# Altium project ControllerV1.0.PrjPcb
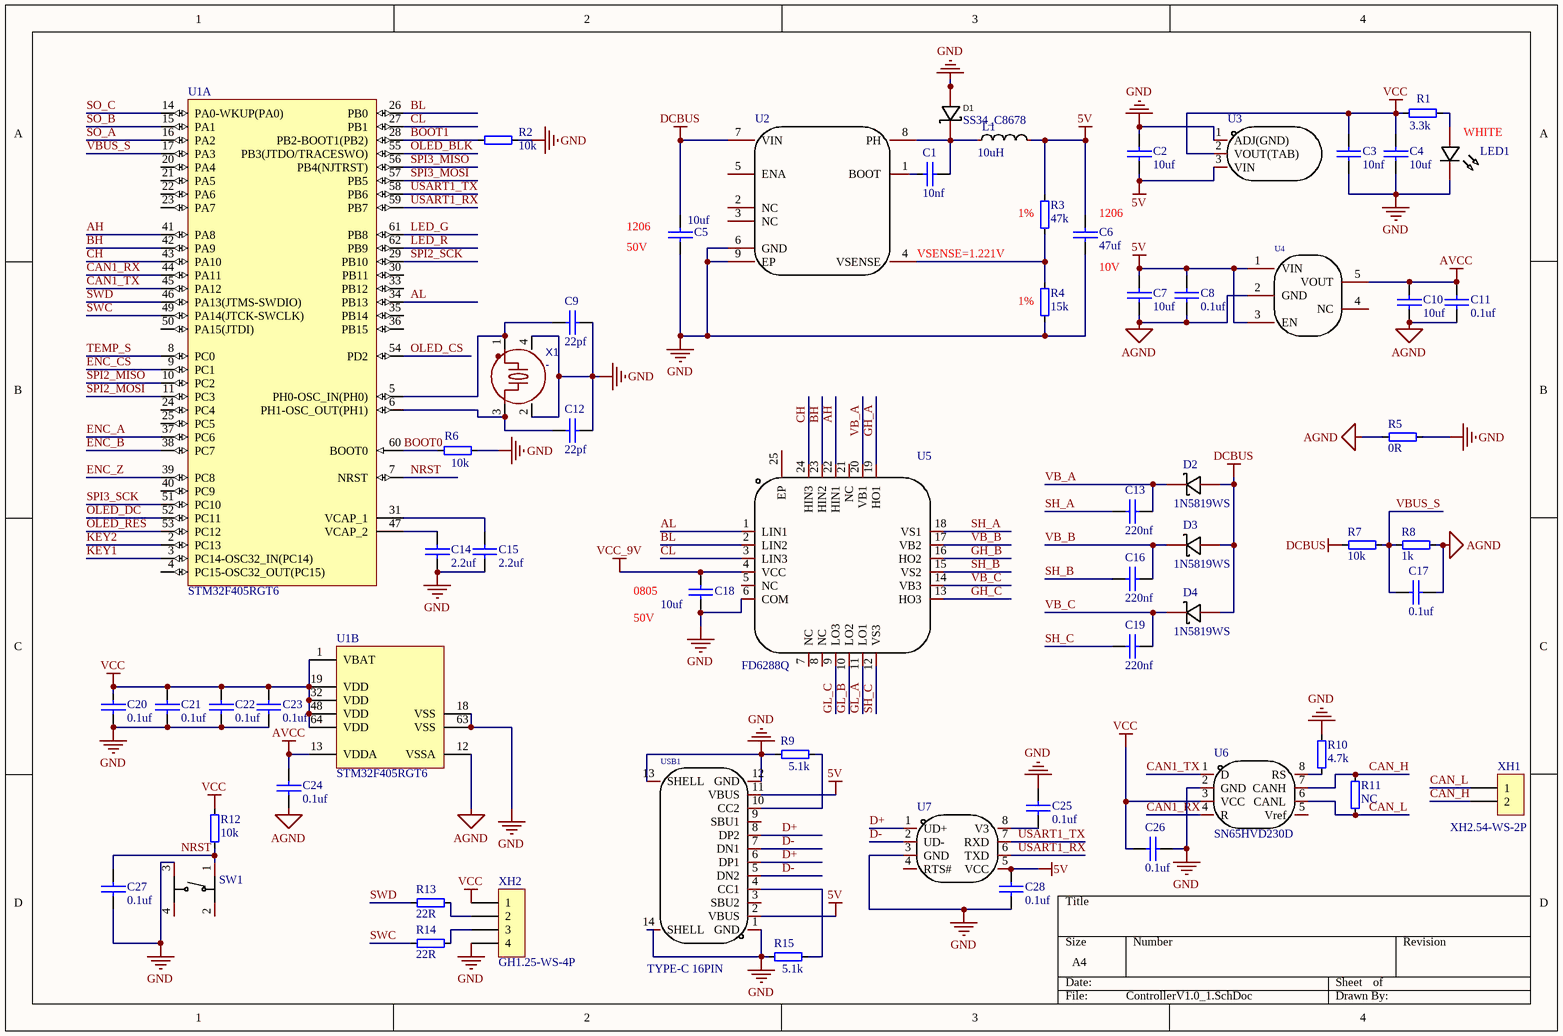
[diagram p0: ControllerV1.0_1.SchDoc]
2 sheets, 92 parts. Net scope: global (net labels, ports and power ports of the same name join across sheets).
Board file: ControllerV1.0.PcbDoc
Sheets:
  ControllerV1.0_1.SchDoc
  ControllerV1.0_2.SchDoc

## Sheet ControllerV1.0_1.SchDoc
size A4; SheetNumber: 1; SheetTotal: 2

### Parts
C1  10nf  [0603C]
C2  10uf  [0603C]
C3  10nf  [0603C]
C4  10uf  [0603C]
C5  10uf  [1206C]
C6  47uf  [1206C]
C7  10uf  [0603C]
C8  0.1uf  [0603C]
C9  22pf  [0603C]
C10  10uf  [0603C]
C11  0.1uf  [0603C]
C12  22pf  [0603C]
C13  220nf  [0603C]
C14  2.2uf  [0603C]
C15  2.2uf  [0603C]
C16  220nf  [0603C]
C17  0.1uf  [0603C]
C18  10uf  [0805C]
C19  220nf  [0603C]
C20  0.1uf  [0603C]
C21  0.1uf  [0603C]
C22  0.1uf  [0603C]
C23  0.1uf  [0603C]
C24  0.1uf  [0603C]
C25  0.1uf  [0603C]
C26  0.1uf  [0603C]
C27  0.1uf  [0603C]
C28  0.1uf  [0603C]
D1  SS34_C8678  [SS34]
D2  1N5819WS  [SOD-323]
D3  1N5819WS  [SOD-323]
D4  1N5819WS  [SOD-323]
L1  10uH  [IND-SMD_L3.0-W3.0_SWPA3010S]
LED1  LED_0603-B  [LED_0603]  (value not drawn)
R1  3.3k  [0603R]
R2  10k  [0603R]
R3  47k  [0603R]
R4  15k  [0603R]
R5  0R  [0603R]
R6  10k  [0603R]
R7  10k  [0603R]
R8  1k  [0603R]
R9  5.1k  [0603R]
R10  4.7k  [0603R]
R11  NC  [0603R]
R12  10k  [0603R]
R13  22R  [0603R]
R14  22R  [0603R]
R15  5.1k  [0603R]
SW1  TS-1187A-B-A-B  [TSW SMD-4*4*1.5]  (value not drawn)
U1  STM32F405RGT6  [LQFP_64]  (parts A,B of 2)
U2  TPS5450DDAR  [SOP-8-EP]  (value not drawn)
U3  AMS1117-3.3_C347256  [SOT-89]  (value not drawn)
U4  RT9013-33GB  [SOT-23-5]  (value not drawn)
U5  FD6288Q  [QFN-24-EP(4x4)]
U6  SN65HVD230D  [SOP-8]
U7  CH340N  [SOP-8]  (value not drawn)
USB1  TYPE-C 16PIN  [USB-C-SMD_TYPE-C-6PIN-2MD-073]
X1  -  [OSC 2520-4P]
XH1  XH2.54-WS-2P  [XH2.54-WS-2P]
XH2  GH1.25-WS-4P  [GH1.25-WS-4P]

### Nets
5V: C2.2 C6.1 C7.1 C8.1 C28.1 L1.2 R3.2 U3.3(VIN) U4.1(VIN) U4.3(EN) U7.5(VCC) USB1.2(VBUS) USB1.11(VBUS)
AGND: C7.2 C8.2 C10.2 C11.2 C17.2 C24.2 R5.2 R8.1 U1.12(VSSA) U4.2(GND)
AVCC: C10.1 C11.1 C24.1 U1.13(VDDA) U4.5(VOUT)
DCBUS: C5.1 D2.2(A) D3.2(A) D4.2(A) R7.2 U2.7(VIN)
GND: C2.1 C3.2 C4.2 C5.2 C6.2 C9.2 C12.2 C14.2 C15.2 C18.2 C20.2 C21.2 C22.2 C23.2 C25.2 C26.2 C27.2 C28.2 D1.2(A) LED1.1(C) R2.2 R4.1 R5.1 R6.2 R9.1 R10.2 R15.1 SW1.3(C) U1.18(VSS) U1.63(VSS) U2.6(GND) U2.9(EP) U3.1(ADJ(GND)) U5.6(COM) U6.2(GND) U7.3(GND) USB1.1(GND) USB1.12(GND) USB1.13(SHELL) USB1.14(SHELL) X1.2(GND) X1.4(GND) XH2.4
VCC: C3.1 C4.1 C20.1 C21.1 C22.1 C23.1 C26.1 R1.2 R12.2 U1.1(VBAT) U1.19(VDD) U1.32(VDD) U1.48(VDD) U1.64(VDD) U3.2(VOUT(TAB)) U6.3(VCC) XH2.1
VCC_9V: C18.1 U5.4(VCC)
AH: U1.41(PA8) U5.22(HIN1)
AL: U1.34(PB13) U5.1(LIN1)
BH: U1.42(PA9) U5.23(HIN2)
BL: U1.26(PB0) U5.2(LIN2)
BOOT0: R6.1 U1.60(BOOT0)
BOOT1: R2.1 U1.28(PB2-BOOT1(PB2))
CAN1_RX: U1.44(PA11) U6.4(R)
CAN1_TX: U1.45(PA12) U6.1(D)
CAN_H: R11.2 U6.7(CANH) XH1.2
CAN_L: R11.1 U6.6(CANL) XH1.1
CH: U1.43(PA10) U5.24(HIN3)
CL: U1.27(PB1) U5.3(LIN3)
D+: U7.1(UD+) USB1.6(DP1) USB1.8(DP2)
D-: U7.2(UD-) USB1.5(DN2) USB1.7(DN1)
ENC_A: U1.37(PC6)
ENC_B: U1.38(PC7)
ENC_CS: U1.9(PC1)
ENC_Z: U1.39(PC8)
GH_A: U5.19(HO1)
GH_B: U5.16(HO2)
GH_C: U5.13(HO3)
GL_A: U5.11(LO1)
GL_B: U5.10(LO2)
GL_C: U5.9(LO3)
KEY1: U1.3(PC14-OSC32_IN(PC14))
KEY2: U1.2(PC13)
LED_G: U1.61(PB8)
LED_R: U1.62(PB9)
NRST: C27.1 R12.1 SW1.1(A) U1.7(NRST)
OLED_BLK: U1.55(PB3(JTDO/TRACESWO))
OLED_CS: U1.54(PD2)
OLED_DC: U1.52(PC11)
OLED_RES: U1.53(PC12)
SH_A: C13.1 U5.18(VS1)
SH_B: C16.1 U5.15(VS2)
SH_C: C19.1 U5.12(VS3)
SO_A: U1.16(PA2)
SO_B: U1.15(PA1)
SO_C: U1.14(PA0-WKUP(PA0))
SPI2_MISO: U1.10(PC2)
SPI2_MOSI: U1.11(PC3)
SPI2_SCK: U1.29(PB10)
SPI3_MISO: U1.56(PB4(NJTRST))
SPI3_MOSI: U1.57(PB5)
SPI3_SCK: U1.51(PC10)
SWC: R14.1 U1.49(PA14(JTCK-SWCLK))
SWD: R13.1 U1.46(PA13(JTMS-SWDIO))
TEMP_S: U1.8(PC0)
USART1_RX: U1.59(PB7) U7.6(TXD)
USART1_TX: U1.58(PB6) U7.7(RXD)
VB_A: C13.2 D2.1(K) U5.20(VB1)
VB_B: C16.2 D3.1(K) U5.17(VB2)
VB_C: C19.2 D4.1(K) U5.14(VB3)
VBUS_S: C17.1 R7.1 R8.2 U1.17(PA3)
NetC1_1: C1.1 U2.1(BOOT)
NetC1_2: C1.2 D1.1(K) L1.1 U2.8(PH)
NetC9_1: C9.1 U1.5(PH0-OSC_IN(PH0)) X1.1
NetC12_1: C12.1 U1.6(PH1-OSC_OUT(PH1)) X1.3
NetC14_1: C14.1 U1.47(VCAP_2)
NetC15_1: C15.1 U1.31(VCAP_1)
NetC25_1: C25.1 U7.8(V3)
NetLED1_2: LED1.2(A) R1.1
NetR3_1: R3.1 R4.2 U2.4(VSENSE)
NetR9_2: R9.2 USB1.10(CC2)
NetR10_1: R10.1 U6.8(RS)
NetR13_2: R13.2 XH2.2
NetR14_2: R14.2 XH2.3
NetR15_2: R15.2 USB1.4(CC1)

Not connected (* = marked no-connect by the designer): SW1 2(B) 4(D); U1 4(PC15-OSC32_OUT(PC15)) 20(PA4) 21(PA5) 22(PA6) 23(PA7) 24(PC4) 25(PC5) 30(PB11) 33(PB12) 35(PB14) 36(PB15) 40(PC9) 50(PA15(JTDI)); U2 2(NC) 3(NC) 5(ENA); U4 4(NC); U5 5(NC) 7(NC) 8(NC) 21(NC) 25(EP); U6 5(Vref); U7 4(RTS#); USB1 3(SBU2) 9(SBU1)

### Notes on the sheet
- (near LED1) WHITE
- (near C5) 1206
- (near C5) 50V
- (near R3) 1%
- (near C6) 1206
- (near U2) VSENSE=1.221V
- (near R4) 1%
- 10V
- (near C18) 0805
- (near C18) 50V

### Library data of the parts
C1-C28 = CAP: 贴片电容
D1 = SS34: 肖特基二极管; Manufacturer: MDD; Add into BOM: yes; Name: SS34; Symbol: SS34_C8678; Device: SS34_C8678; LCSC Part Name: SS34; Supplier Part: C8678; Manufacturer Part: SS34; Supplier Footprint: SMA(DO-214AC); JLCPCB Part Class: Basic Part; Datasheet: https://atta.szlcsc.com/upload/public/pdf/source/20220408/D0396E57A6E83C6AFC0ED25EC9EDE030.pdf; Supplier: LCSC; Convert to PCB: yes
D2-D4 = 1N5819WS: 肖特基二极管; Manufacturer: Hottech(合科泰); Device: 1N5819WS_C191023; Add into BOM: yes; Forward Voltage (Vf@If): 600mV@1A; Reverse Voltage (Vr): 40V; Average Rectified Current (Io): 1A; Symbol: 1N5819WS; Supplier: LCSC; Supplier Part: C191023; Manufacturer Part: 1N5819WS; JLCPCB Part Class: 基础库; LCSC Part Name: 电压:40V 电流:1A; Supplier Footprint: SOD-323; Datasheet: https://atta.szlcsc.com/upload/public/pdf/source/20220428/3CB86FD8D28D653594B4E35F9D5AEFD9.pdf; Convert to PCB: yes
L1 = SWPA3015S100MT: 电感值:10uH;精度:±20%;额定电流:920mA;; Manufacturer: SXN(顺翔诺); Symbol: SMDRI74-220M; Add into BOM: yes; Value: 22uH; Tolerance: ±20%; Rated Current: 1.23A; DC Resistance (DCR): 110mΩ; Device: SMDRI74-220M; LCSC Part Name: 22uH ±20% 1.23A 110mΩ; Supplier Part: C164083; Manufacturer Part: SMDRI74-220M; Supplier Footprint: SMD; JLCPCB Part Class: Extended Part; Datasheet: https://atta.szlcsc.com/upload/public/pdf/source/20210810/6F96FDC19AA308DD2AD166FFB9640E87.pdf; Supplier: LCSC; Convert to PCB: yes
LED1 = LED: Symbol: LED_B; Convert to PCB: yes; Device: LED_0603-B; Add into BOM: yes; Supplier Footprint: 0603
R1-R15 = RES: 贴片电阻
SW1 = TS-1187A-B-A-B: 轻触开关; Manufacturer: XKB Connectivity(中国星坤); Add into BOM: yes; Circuit: 单刀单掷; Actuator Style: 圆形按钮; Switch Length: 5.1mm; Switch Height: 1.5mm; Strike Gundam: 不带; Contact Current: 50mA; Voltage Rating (DC): 12V; Actuator/Cap Color: 金色; With Lamp: 无; Operating Force: 160gf; Mechanical Life: 10万次; Symbol: TS-1187A-B-A-B; Device: TS-1187A-B-A-B; Supplier: LCSC; Supplier Part: C318884; Manufacturer Part: TS-1187A-B-A-B; JLCPCB Part Class: 基础库; LCSC Part Name: 5.1*5.1*1.5mm 立贴 轻触开关; Supplier Footprint: SMD; Datasheet: https://atta.szlcsc.com/upload/public/pdf/source/20200227/C318890_053E50208A88A7BA1965D8746000774E.pdf; Convert to PCB: yes; Switch Width: 5.1mm; Mounting Style: 立贴; Insulation Resistance: -; Operating Temperature: -30℃~+85℃
U1 = STM32F405RGT6: ARM Cortex-M4 32-bit MCU+FPU, 210 DMIPS, 1024 kB Flash, 192 kB Internal RAM, 51 I/Os, 64-pin LQFP, -40 to 85 degC, Tray; Manufacturer: STMicroelectronics; D/A Converter: 2x12-bit; FLASH Size (Prog) (kB): 1024; I/Os (High Current): 51; Internal RAM Size (kB): 192; Operating Frequency(F) (Processor speed) (MHz): 168; Supply Voltage(Vcc) max (V): 3.6; Supply Voltage(Vcc) min (V): 1.8; DatasheetVersion: Rev. 4; PackageVersion: Rev. 4, 06/2013; PackageReference: LQFP64; PackageDescription: 64-Pin Low Profile Quad Flat Package, 10 x 10 mm Body, 0.5 mm Pitch; Supplier 1: Digi-Key; Supplier Part Number 1: 497-11767-ND; Supplier 2: Farnell; Supplier Part Number 2: 2064363; Supplier 3: Newark; Supplier Part Number 3: 73T2329; Supplier 4: Mouser; Supplier Part Number 4: 511-STM32F405RGT6; Core: ARM Cortex-M4; Packing: Tray; Mounting Technology: Surface Mount; PartNumber: STM32F405RGT6; ComponentLink1Description: Manufacturer URL; ComponentLink1URL: http://www.st.com/web/en/home.html; ComponentLink2Description: Datasheet; ComponentLink2URL: http://www.st.com/st-web-ui/static/active/en/resource/technical/document/datasheet/DM00037051.pdf; ComponentLink3Description: Package Specification; ComponentLink3URL: http://www.st.com/st-web-ui/static/active/en/resource/technical/document/datasheet/DM00037051.pdf
U2 = TPS5450DDAR: Manufacturer: TI(德州仪器); Add into BOM: yes; Function: 降压型; Input Voltage: 5.5V~36V; Output Voltage: 1.221V~31.32V; Output Current (Max): 5A; Switching Frequency: 500kHz; Output Type: 可调; Synchronous Rectification: 否; Number of Outputs: 1; Topology: 降压式; Symbol: TPS5450DDAR; Device: TPS5450DDAR; Supplier: LCSC; Manufacturer Part: TPS5450DDAR; Supplier Part: C114425; JLCPCB Part Class: 扩展库; LCSC Part Name: TPS5450DDAR; Supplier Footprint: SOP-8-EP-150mil; Datasheet: https://www.ti.com/cn/lit/gpn/tps5450; Convert to PCB: yes; Operating Temperature: -40℃~+125℃@(TJ)
U3 = AMS1117-3.3_C347256: 输出类型:固定;输出极性:正;最大输入电压:18V;输出电压:3.3V;输出电流:1A;电源纹波抑制比(PSRR):60dB@(120Hz);; Manufacturer: UMW(友台半导体); Add into BOM: yes; Output Type: 固定; Output Polarity: 正; Number of Outputs: 1; Maximum Input Voltage: 18V; Output Voltage: 3.3V; Dropout Voltage: 1.3V@(1A); Output Current: 1A; Symbol: AMS1117-3.3_C347256; Device: AMS1117-3.3_C347256; LCSC Part Name: 输入18V 输出3.3V 1A; Supplier Part: C347256; Manufacturer Part: AMS1117-3.3; Supplier Footprint: SOT-89; JLCPCB Part Class: 扩展库; Datasheet: https://atta.szlcsc.com/upload/public/pdf/source/20211011/50CC665C22E3A66C08379A4A74BDA25C.pdf; Supplier: LCSC; Convert to PCB: yes; Power Supply Rejection Ratio (PSRR): 60dB@(120Hz)
U4 = RT9013-33GB: 输出类型:固定;输出极性:正;最大输入电压:5.5V;输出电压:3.3V;输出电流:500mA;电源纹波抑制比(PSRR):50dB@(10kHz);; Manufacturer: RICHTEK(立锜); Add into BOM: yes; Output Type: 固定; Output Polarity: 正; Number of Outputs: 1; Maximum Input Voltage: 5.5V; Output Voltage: 3.3V; Dropout Voltage: 400mV@(500mA); Quiescent Current (Ground Current): 50uA; Output Current: 500mA; Symbol: RT9013-33GB; Device: RT9013-33GB; LCSC Part Name: 输入5.5V 输出3.3V 500mA; Supplier Part: C47773; Manufacturer Part: RT9013-33GB; Supplier Footprint: SOT-23-5; JLCPCB Part Class: 扩展库; Datasheet: https://atta.szlcsc.com/upload/public/pdf/source/20150504/1457707282459.pdf; Supplier: LCSC; Convert to PCB: yes; Power Supply Rejection Ratio (PSRR): 50dB@(10kHz); Noise: -; Feature: -; Operating Temperature: -40℃~+85℃
U5 = FD6288Q: Manufacturer: Fortior Tech(峰岹); Symbol: FD6288Q_C328453; Add into BOM: yes; Device: FD6288Q; Supplier: LCSC; Supplier Part: C328453; Manufacturer Part: FD6288Q; JLCPCB Part Class: Extended Part; LCSC Part Name: FD6288Q; Supplier Footprint: QFN-24-EP(4x4); Datasheet: https://atta.szlcsc.com/upload/public/pdf/source/20181108/C328453_785547738DB9FC0123219FC22539EFAD.pdf; Convert to PCB: yes
U6 = SN65HVD230D: 具有待机模式的 3.3V CAN 收发器 8-SOIC -40 to 85; Manufacturer: TI(德州仪器); Add into BOM: yes; Symbol: SN65HVD230D; Device: SN65HVD230D; LCSC Part Name: SN65HVD230D; Supplier Part: C1543812; Manufacturer Part: SN65HVD230D; Supplier Footprint: SOIC-8; JLCPCB Part Class: 扩展库; Supplier: LCSC; Convert to PCB: yes
U7 = CH340N: Manufacturer: WCH(南京沁恒); Symbol: CH340N_C2977777; Add into BOM: yes; Device: CH340N; LCSC Part Name: USB转串口芯片 CH340; Supplier Part: C2977777; Manufacturer Part: CH340N; Supplier Footprint: SOP-8; JLCPCB Part Class: 扩展库; Datasheet: https://atta.szlcsc.com/upload/public/pdf/source/20220223/82A45E4FF89B3EDCAD50B354450A7EF4.pdf; Supplier: LCSC; Convert to PCB: yes
USB1 = TYPE-C 16PIN 2MD(073): 连接器类型:Type-C;标准:-;公母:母座;触点数量:16;端口数量:1;安装方式:卧贴;额定电流 - 电源:5A;工作温度范围:-25℃~+85℃;; Manufacturer: SHOU HAN(首韩); Add into BOM: yes; Gender: 母座; Number of Contacts: 16; Number of Ports: 1; Current Rating - Power (Max): 5A; Symbol: TYPE-C 16PIN 2MD(073); Device: TYPE-C 16PIN 2MD(073); LCSC Part Name: TYPE-C母座 16P 4脚插件带定位柱 不锈钢外壳 2次模顶; Supplier Part: C2765186; Manufacturer Part: TYPE-C 16PIN 2MD(073); Supplier Footprint: SMD; JLCPCB Part Class: 扩展库; Supplier: LCSC; Convert to PCB: yes; Connector Type: Type-C; Standard: -; Mounting Style: 卧贴; Operating Temperature Range: -25℃~+85℃
X1 = 四脚晶振: 8MHz; BOM_Manufacturer: NDK; BOM_Manufacturer Part: NX2016SA-32MHZ-STD-CZS-5; Contributor: LCSC; nameAlias: Frequency; BOM_Supplier: LCSC; BOM_Supplier Part: C843260; BOM_JLCPCB Part Class: Extended Part; spicePre: X; spiceSymbolName: NX2016SA-32MHZ-STD-CZS-5

## Sheet ControllerV1.0_2.SchDoc
size A4; SheetNumber: 2; SheetTotal: 2
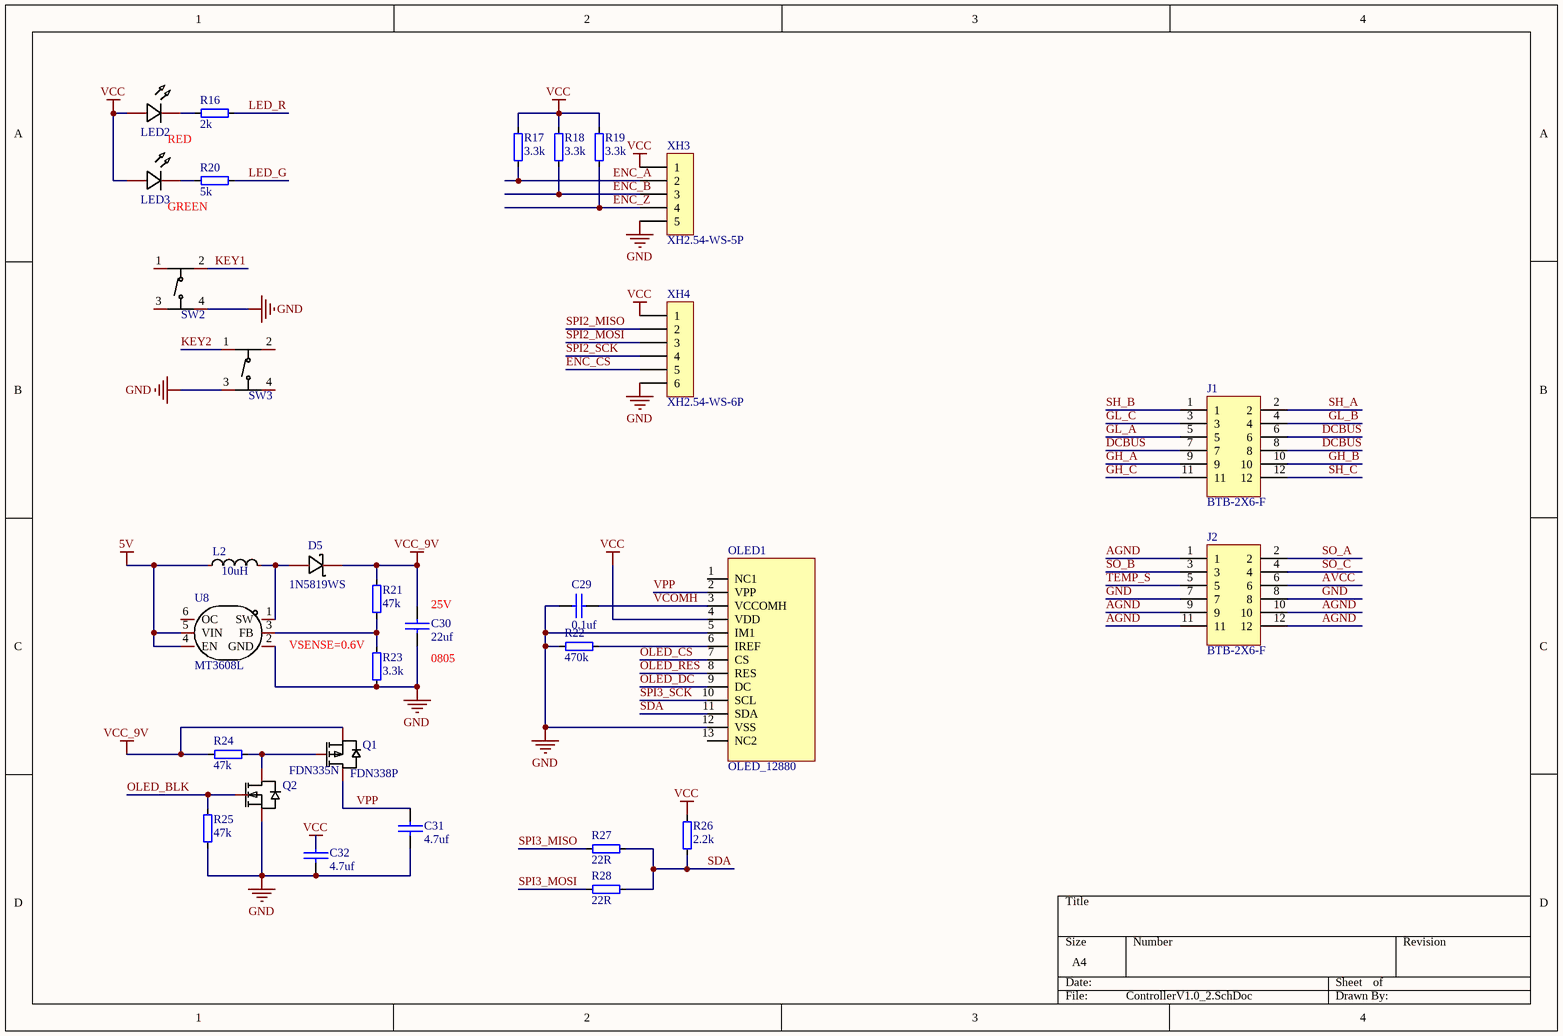
[diagram p1: ControllerV1.0_2.SchDoc]

### Parts
C29  0.1uf  [0603C]
C30  22uf  [0805C]
C31  4.7uf  [0603C]
C32  4.7uf  [0603C]
D5  1N5819WS  [SOD-323]
J1  BTB-2X6-F  [BTB-F-0.8mm-2x6P]
J2  BTB-2X6-F  [BTB-F-0.8mm-2x6P]
L2  10uH  [IND-SMD_L3.0-W3.0_SWPA3010S]
LED2  LED_0603-B  [LED_0603]  (value not drawn)
LED3  LED_0603-B  [LED_0603]  (value not drawn)
OLED1  OLED_12880  [OLED_12880]
Q1  FDN338P  [SOT-23-3]
Q2  FDN335N  [SOT-23-3]
R16  2k  [0603R]
R17  3.3k  [0603R]
R18  3.3k  [0603R]
R19  3.3k  [0603R]
R20  5k  [0603R]
R21  47k  [0603R]
R22  470k  [0603R]
R23  3.3k  [0603R]
R24  47k  [0603R]
R25  47k  [0603R]
R26  2.2k  [0603R]
R27  22R  [0603R]
R28  22R  [0603R]
SW2  TS-1187A-B-A-B  [TSW SMD-4*4*1.5]  (value not drawn)
SW3  TS-1187A-B-A-B  [TSW SMD-4*4*1.5]  (value not drawn)
U8  MT3608L  [SOT-23-6]
XH3  XH2.54-WS-5P  [XH2.54-WS-5P]
XH4  XH2.54-WS-6P  [XH2.54-WS-6P]

### Nets
5V: L2.1 U8.4(EN) U8.5(VIN)
AGND: J2.1 J2.9 J2.10 J2.11 J2.12
AVCC: J2.6
DCBUS: J1.6 J1.7 J1.8
GND: C29.1 C30.2 C31.2 C32.2 J2.7 J2.8 OLED1.5(IM1) OLED1.12(VSS) Q2.2(S) R22.1 R23.1 R25.1 SW2.4(D) SW3.3(C) U8.2(GND) XH3.5 XH4.6
VCC: C32.1 LED2.2(A) LED3.2(A) OLED1.4(VDD) R17.2 R18.2 R19.2 R26.2 XH3.1 XH4.1
VCC_9V: C30.1 D5.1(K) Q1.2(S) R21.2 R24.1
ENC_A: R17.1 XH3.2
ENC_B: R18.1 XH3.3
ENC_CS: XH4.5
ENC_Z: R19.1 XH3.4
GH_A: J1.9
GH_B: J1.10
GH_C: J1.11
GL_A: J1.5
GL_B: J1.4
GL_C: J1.3
KEY1: SW2.2(B)
KEY2: SW3.1(A)
LED_G: R20.2
LED_R: R16.2
OLED_BLK: Q2.1(G) R25.2
OLED_CS: OLED1.7(CS)
OLED_DC: OLED1.9(DC)
OLED_RES: OLED1.8(RES)
SDA: OLED1.11(SDA) R26.1 R27.2 R28.2
SH_A: J1.2
SH_B: J1.1
SH_C: J1.12
SO_A: J2.2
SO_B: J2.3
SO_C: J2.4
SPI2_MISO: XH4.2
SPI2_MOSI: XH4.3
SPI2_SCK: XH4.4
SPI3_MISO: R27.1
SPI3_MOSI: R28.1
SPI3_SCK: OLED1.10(SCL)
TEMP_S: J2.5
VCOMH: C29.2 OLED1.3(VCCOMH)
VPP: C31.1 OLED1.2(VPP) Q1.3(D)
NetD5_2: D5.2(A) L2.2 U8.1(SW)
NetLED2_1: LED2.1(C) R16.1
NetLED3_1: LED3.1(C) R20.1
NetOLED1_6: OLED1.6(IREF) R22.2
NetQ1_1: Q1.1(G) Q2.3(D) R24.2
NetR21_1: R21.1 R23.2 U8.3(FB)

Not connected (* = marked no-connect by the designer): OLED1 1(NC1) 13(NC2); SW2 1(A) 3(C); SW3 2(B) 4(D); U8 6(OC)

### Notes on the sheet
- RED
- GREEN
- VSENSE=0.6V
- (near C30) 25V
- (near C30) 0805

### Library data of the parts
C29-C32 = CAP: 贴片电容
D5 = 1N5819WS: as D2 on sheet ControllerV1.0_1; Symbol: 1N5819WS; Supplier: LCSC; Supplier Part: C191023; Manufacturer Part: 1N5819WS; JLCPCB Part Class: 基础库; LCSC Part Name: 电压:40V 电流:1A; Supplier Footprint: SOD-323; Datasheet: https://atta.szlcsc.com/upload/public/pdf/source/20220428/3CB86FD8D28D653594B4E35F9D5AEFD9.pdf; Convert to PCB: yes
J1 J2 = BTB-2X6-F: 0.8间距2x6P母座
L2 = SWPA3015S100MT: as L1 on sheet ControllerV1.0_1; Device: SMDRI74-220M; LCSC Part Name: 22uH ±20% 1.23A 110mΩ; Supplier Part: C164083; Manufacturer Part: SMDRI74-220M; Supplier Footprint: SMD; JLCPCB Part Class: Extended Part; Datasheet: https://atta.szlcsc.com/upload/public/pdf/source/20210810/6F96FDC19AA308DD2AD166FFB9640E87.pdf; Supplier: LCSC; Convert to PCB: yes
LED2 LED3 = LED: Symbol: LED_B; Convert to PCB: yes; Device: LED_0603-B; Add into BOM: yes; Supplier Footprint: 0603
OLED1 = OLED_12880: OLED_128*80
Q1 = FDN338P: P沟道 耐压:20V 电流:2A; Manufacturer: TECH PUBLIC(台舟); Symbol: FDN338P_C2890130; Add into BOM: yes; Device: FDN338P; LCSC Part Name: FDN338P; Supplier Part: C2890130; Manufacturer Part: FDN338P; Supplier Footprint: SOT-23; JLCPCB Part Class: 扩展库; Datasheet: https://atta.szlcsc.com/upload/public/pdf/source/20210903/7E6CB84F0F80073F6978D1021964D836.pdf; Supplier: LCSC; Convert to PCB: yes
Q2 = FDN335N: N沟道 耐压:20V 电流:1.7A; Manufacturer: TECH PUBLIC(台舟); Symbol: FDN335N_C5123904; Add into BOM: yes; Device: FDN335N_C5123904; Supplier: LCSC; Supplier Part: C5123904; Manufacturer Part: FDN335N; JLCPCB Part Class: 扩展库; LCSC Part Name: FDN335N; Supplier Footprint: SOT-23(TO-236); Datasheet: https://atta.szlcsc.com/upload/public/pdf/source/20221011/C6D62871DD587F26C6CC0F7FCE0BC659.pdf; Convert to PCB: yes
R16-R28 = RES: 贴片电阻
SW2 SW3 = TS-1187A-B-A-B: as SW1 on sheet ControllerV1.0_1; Symbol: TS-1187A-B-A-B; Device: TS-1187A-B-A-B; Supplier: LCSC; Supplier Part: C318884; Manufacturer Part: TS-1187A-B-A-B; JLCPCB Part Class: 基础库; LCSC Part Name: 5.1*5.1*1.5mm 立贴 轻触开关; Supplier Footprint: SMD; Datasheet: https://atta.szlcsc.com/upload/public/pdf/source/20200227/C318890_053E50208A88A7BA1965D8746000774E.pdf; Convert to PCB: yes; Switch Width: 5.1mm; Mounting Style: 立贴; Insulation Resistance: -; Operating Temperature: -30℃~+85℃
U8 = MT3608L: Manufacturer: 西安航天民芯; Add into BOM: yes; Symbol: MT3608L; Device: MT3608L; LCSC Part Name: MT3608L; Supplier Part: C2932326; Manufacturer Part: MT3608L; Supplier Footprint: SOT-23-6; JLCPCB Part Class: 扩展库; Datasheet: https://atta.szlcsc.com/upload/public/pdf/source/20211213/953A62CC1033762E00AABAD4906DD7F1.pdf; Supplier: LCSC; Convert to PCB: yes

## Nets that join several sheets
5V: ControllerV1.0_1 (13 pins), ControllerV1.0_2 (L2.1 U8.4 U8.5)
AGND: ControllerV1.0_1 (10 pins), ControllerV1.0_2 (5 pins)
AVCC: ControllerV1.0_1 (5 pins), ControllerV1.0_2 (J2.6)
DCBUS: ControllerV1.0_1 (6 pins), ControllerV1.0_2 (J1.6 J1.7 J1.8)
GND: ControllerV1.0_1 (43 pins), ControllerV1.0_2 (17 pins)
VCC: ControllerV1.0_1 (17 pins), ControllerV1.0_2 (10 pins)
VCC_9V: ControllerV1.0_1 (C18.1 U5.4), ControllerV1.0_2 (5 pins)
ENC_A: ControllerV1.0_1 (U1.37), ControllerV1.0_2 (R17.1 XH3.2)
ENC_B: ControllerV1.0_1 (U1.38), ControllerV1.0_2 (R18.1 XH3.3)
ENC_CS: ControllerV1.0_1 (U1.9), ControllerV1.0_2 (XH4.5)
ENC_Z: ControllerV1.0_1 (U1.39), ControllerV1.0_2 (R19.1 XH3.4)
GH_A: ControllerV1.0_1 (U5.19), ControllerV1.0_2 (J1.9)
GH_B: ControllerV1.0_1 (U5.16), ControllerV1.0_2 (J1.10)
GH_C: ControllerV1.0_1 (U5.13), ControllerV1.0_2 (J1.11)
GL_A: ControllerV1.0_1 (U5.11), ControllerV1.0_2 (J1.5)
GL_B: ControllerV1.0_1 (U5.10), ControllerV1.0_2 (J1.4)
GL_C: ControllerV1.0_1 (U5.9), ControllerV1.0_2 (J1.3)
KEY1: ControllerV1.0_1 (U1.3), ControllerV1.0_2 (SW2.2)
KEY2: ControllerV1.0_1 (U1.2), ControllerV1.0_2 (SW3.1)
LED_G: ControllerV1.0_1 (U1.61), ControllerV1.0_2 (R20.2)
LED_R: ControllerV1.0_1 (U1.62), ControllerV1.0_2 (R16.2)
OLED_BLK: ControllerV1.0_1 (U1.55), ControllerV1.0_2 (Q2.1 R25.2)
OLED_CS: ControllerV1.0_1 (U1.54), ControllerV1.0_2 (OLED1.7)
OLED_DC: ControllerV1.0_1 (U1.52), ControllerV1.0_2 (OLED1.9)
OLED_RES: ControllerV1.0_1 (U1.53), ControllerV1.0_2 (OLED1.8)
SH_A: ControllerV1.0_1 (C13.1 U5.18), ControllerV1.0_2 (J1.2)
SH_B: ControllerV1.0_1 (C16.1 U5.15), ControllerV1.0_2 (J1.1)
SH_C: ControllerV1.0_1 (C19.1 U5.12), ControllerV1.0_2 (J1.12)
SO_A: ControllerV1.0_1 (U1.16), ControllerV1.0_2 (J2.2)
SO_B: ControllerV1.0_1 (U1.15), ControllerV1.0_2 (J2.3)
SO_C: ControllerV1.0_1 (U1.14), ControllerV1.0_2 (J2.4)
SPI2_MISO: ControllerV1.0_1 (U1.10), ControllerV1.0_2 (XH4.2)
SPI2_MOSI: ControllerV1.0_1 (U1.11), ControllerV1.0_2 (XH4.3)
SPI2_SCK: ControllerV1.0_1 (U1.29), ControllerV1.0_2 (XH4.4)
SPI3_MISO: ControllerV1.0_1 (U1.56), ControllerV1.0_2 (R27.1)
SPI3_MOSI: ControllerV1.0_1 (U1.57), ControllerV1.0_2 (R28.1)
SPI3_SCK: ControllerV1.0_1 (U1.51), ControllerV1.0_2 (OLED1.10)
TEMP_S: ControllerV1.0_1 (U1.8), ControllerV1.0_2 (J2.5)